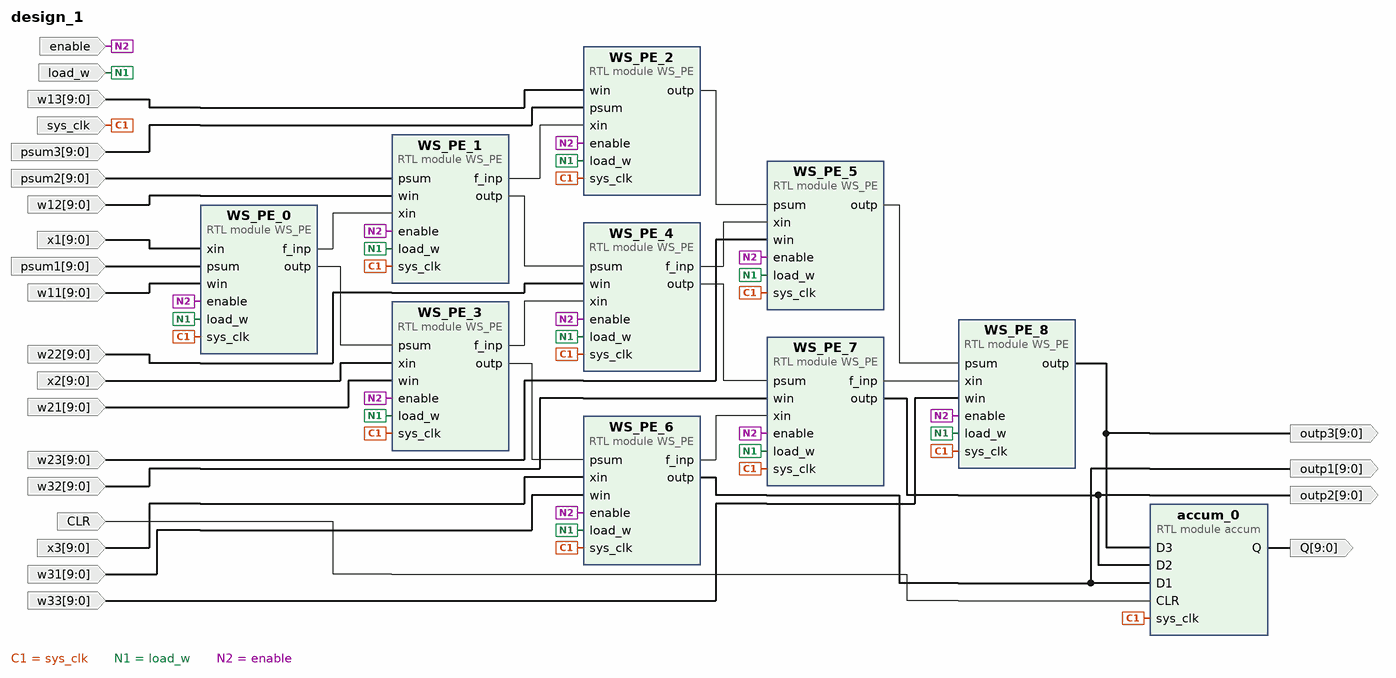
[diagram p0: block diagram of the top level]
# Vivado block design design_1, xc7z020clg400-1, Vivado 2020.2
create_bd_design design_1

create_bd_port -dir I -type clk sys_clk
set_property -dict {CONFIG.FREQ_HZ 100000000} [get_bd_ports sys_clk]
create_bd_port -dir I load_w
create_bd_port -dir I enable
create_bd_port -dir I CLR
create_bd_port -dir O -from 9 -to 0 Q
create_bd_port -dir O -from 9 -to 0 outp2
create_bd_port -dir O -from 9 -to 0 outp3
create_bd_port -dir O -from 9 -to 0 outp1
create_bd_port -dir I -from 9 -to 0 w13
create_bd_port -dir I -from 9 -to 0 psum3
create_bd_port -dir I -from 9 -to 0 psum2
create_bd_port -dir I -from 9 -to 0 w12
create_bd_port -dir I -from 9 -to 0 w22
create_bd_port -dir I -from 9 -to 0 x1
create_bd_port -dir I -from 9 -to 0 psum1
create_bd_port -dir I -from 9 -to 0 w11
create_bd_port -dir I -from 9 -to 0 x2
create_bd_port -dir I -from 9 -to 0 w21
create_bd_port -dir I -from 9 -to 0 w23
create_bd_port -dir I -from 9 -to 0 w32
create_bd_port -dir I -from 9 -to 0 w33
create_bd_port -dir I -from 9 -to 0 x3
create_bd_port -dir I -from 9 -to 0 w31

create_bd_cell -type module -reference accum accum_0
create_bd_cell -type module -reference WS_PE WS_PE_0
create_bd_cell -type module -reference WS_PE WS_PE_1
create_bd_cell -type module -reference WS_PE WS_PE_2
create_bd_cell -type module -reference WS_PE WS_PE_3
create_bd_cell -type module -reference WS_PE WS_PE_6
create_bd_cell -type module -reference WS_PE WS_PE_4
create_bd_cell -type module -reference WS_PE WS_PE_7
create_bd_cell -type module -reference WS_PE WS_PE_5
create_bd_cell -type module -reference WS_PE WS_PE_8

# ---- connections ----

connect_bd_net [get_bd_ports sys_clk] \
  [get_bd_pins accum_0/sys_clk] [get_bd_pins WS_PE_0/sys_clk] [get_bd_pins WS_PE_1/sys_clk] [get_bd_pins WS_PE_2/sys_clk] \
  [get_bd_pins WS_PE_3/sys_clk] [get_bd_pins WS_PE_6/sys_clk] [get_bd_pins WS_PE_4/sys_clk] [get_bd_pins WS_PE_7/sys_clk] \
  [get_bd_pins WS_PE_5/sys_clk] [get_bd_pins WS_PE_8/sys_clk]
connect_bd_net [get_bd_ports load_w] \
  [get_bd_pins WS_PE_0/load_w] [get_bd_pins WS_PE_1/load_w] [get_bd_pins WS_PE_2/load_w] [get_bd_pins WS_PE_3/load_w] \
  [get_bd_pins WS_PE_6/load_w] [get_bd_pins WS_PE_4/load_w] [get_bd_pins WS_PE_7/load_w] [get_bd_pins WS_PE_5/load_w] \
  [get_bd_pins WS_PE_8/load_w]
connect_bd_net [get_bd_ports enable] \
  [get_bd_pins WS_PE_0/enable] [get_bd_pins WS_PE_1/enable] [get_bd_pins WS_PE_2/enable] [get_bd_pins WS_PE_3/enable] \
  [get_bd_pins WS_PE_6/enable] [get_bd_pins WS_PE_4/enable] [get_bd_pins WS_PE_7/enable] [get_bd_pins WS_PE_5/enable] \
  [get_bd_pins WS_PE_8/enable]
connect_bd_net [get_bd_pins WS_PE_0/outp] [get_bd_pins WS_PE_3/psum]
connect_bd_net [get_bd_pins WS_PE_3/outp] [get_bd_pins WS_PE_6/psum]
connect_bd_net [get_bd_pins WS_PE_4/outp] [get_bd_pins WS_PE_7/psum]
connect_bd_net [get_bd_pins WS_PE_0/f_inp] [get_bd_pins WS_PE_1/xin]
connect_bd_net [get_bd_pins WS_PE_1/f_inp] [get_bd_pins WS_PE_2/xin]
connect_bd_net [get_bd_pins WS_PE_1/outp] [get_bd_pins WS_PE_4/psum]
connect_bd_net [get_bd_pins WS_PE_5/outp] [get_bd_pins WS_PE_8/psum]
connect_bd_net [get_bd_pins WS_PE_7/f_inp] [get_bd_pins WS_PE_8/xin]
connect_bd_net [get_bd_pins WS_PE_6/f_inp] [get_bd_pins WS_PE_7/xin]
connect_bd_net [get_bd_pins WS_PE_3/f_inp] [get_bd_pins WS_PE_4/xin]
connect_bd_net [get_bd_pins WS_PE_4/f_inp] [get_bd_pins WS_PE_5/xin]
connect_bd_net [get_bd_pins WS_PE_2/outp] [get_bd_pins WS_PE_5/psum]
connect_bd_net [get_bd_pins WS_PE_6/outp] [get_bd_ports outp1] [get_bd_pins accum_0/D1]
connect_bd_net [get_bd_pins WS_PE_7/outp] [get_bd_ports outp2] [get_bd_pins accum_0/D2]
connect_bd_net [get_bd_ports CLR] [get_bd_pins accum_0/CLR]
connect_bd_net [get_bd_pins WS_PE_8/outp] [get_bd_ports outp3] [get_bd_pins accum_0/D3]
connect_bd_net [get_bd_pins accum_0/Q] [get_bd_ports Q]
connect_bd_net -net w13_1 [get_bd_ports w13] [get_bd_pins WS_PE_2/win]
connect_bd_net -net psum3_1 [get_bd_ports psum3] [get_bd_pins WS_PE_2/psum]
connect_bd_net -net psum2_1 [get_bd_ports psum2] [get_bd_pins WS_PE_1/psum]
connect_bd_net -net w12_1 [get_bd_ports w12] [get_bd_pins WS_PE_1/win]
connect_bd_net -net w22_1 [get_bd_ports w22] [get_bd_pins WS_PE_4/win]
connect_bd_net -net x1_1 [get_bd_ports x1] [get_bd_pins WS_PE_0/xin]
connect_bd_net -net psum1_1 [get_bd_ports psum1] [get_bd_pins WS_PE_0/psum]
connect_bd_net -net w11_1 [get_bd_ports w11] [get_bd_pins WS_PE_0/win]
connect_bd_net -net x2_1 [get_bd_ports x2] [get_bd_pins WS_PE_3/xin]
connect_bd_net -net w21_1 [get_bd_ports w21] [get_bd_pins WS_PE_3/win]
connect_bd_net -net w23_1 [get_bd_ports w23] [get_bd_pins WS_PE_5/win]
connect_bd_net -net w32_1 [get_bd_ports w32] [get_bd_pins WS_PE_7/win]
connect_bd_net -net w33_1 [get_bd_ports w33] [get_bd_pins WS_PE_8/win]
connect_bd_net -net x3_1 [get_bd_ports x3] [get_bd_pins WS_PE_6/xin]
connect_bd_net -net w31_1 [get_bd_ports w31] [get_bd_pins WS_PE_6/win]

validate_bd_design
save_bd_design
